# Altium schematic sheet DG_V3.SchDoc
size A4
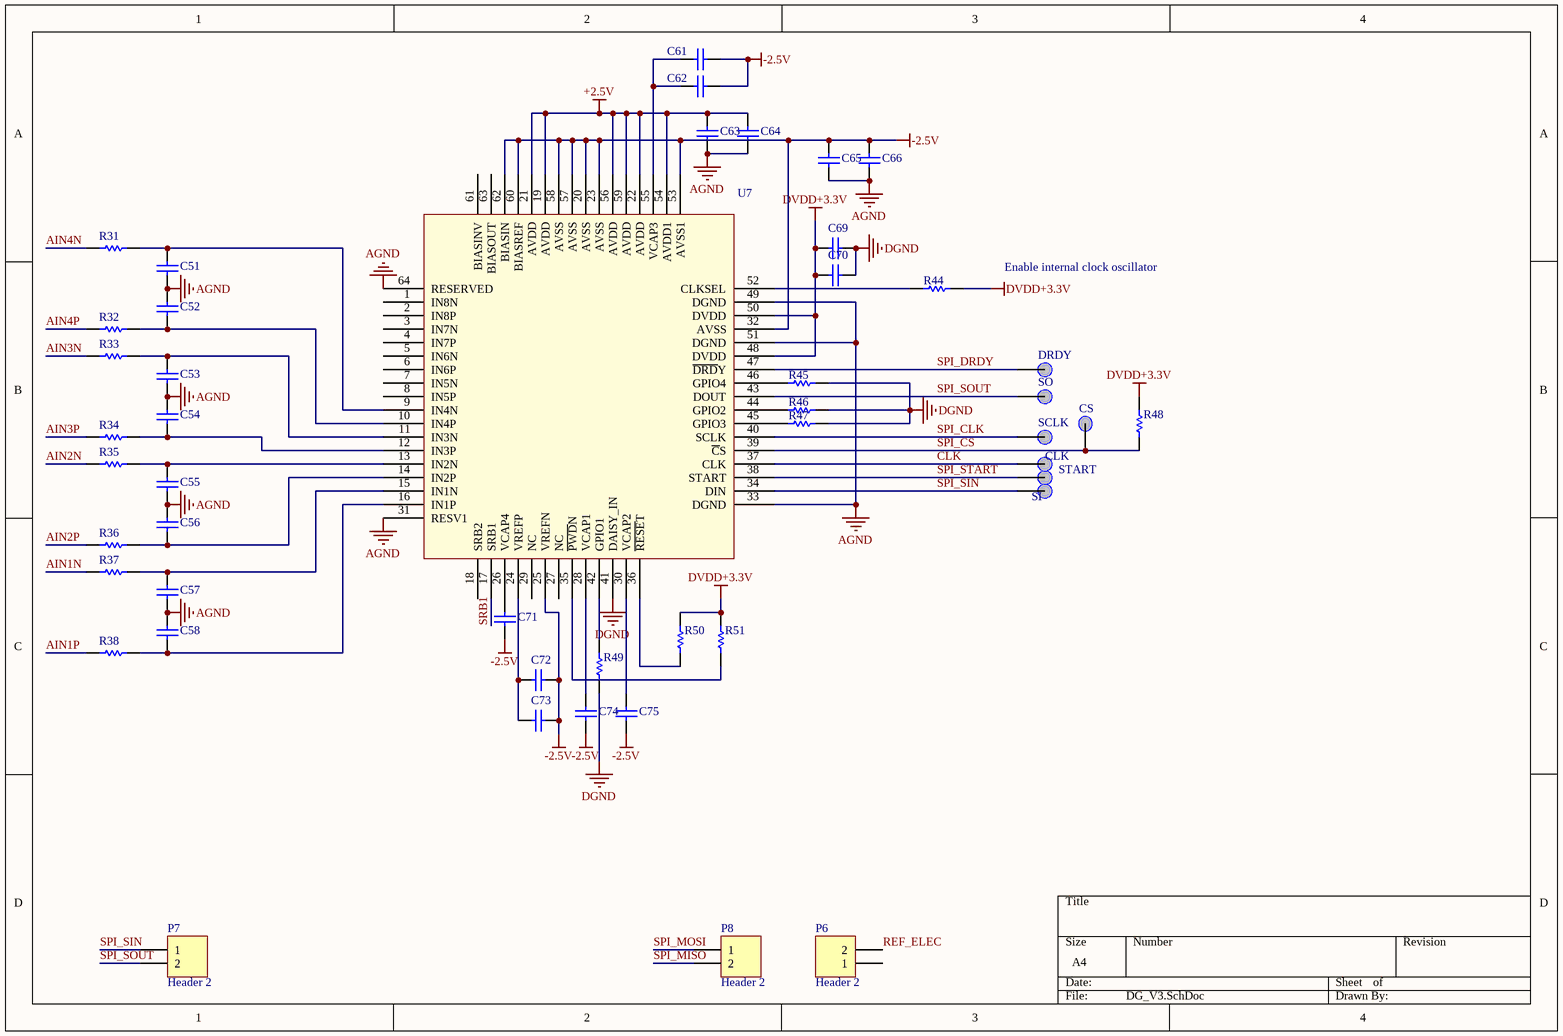
[diagram p0: DG_V3.SchDoc]

## Parts
C51  4.7nF  [1608[0603]]  (value not drawn)
C52  4.7nF  [1608[0603]]  (value not drawn)
C53  4.7nF  [1608[0603]]  (value not drawn)
C54  4.7nF  [1608[0603]]  (value not drawn)
C55  4.7nF  [1608[0603]]  (value not drawn)
C56  4.7nF  [1608[0603]]  (value not drawn)
C57  4.7nF  [1608[0603]]  (value not drawn)
C58  4.7nF  [1608[0603]]  (value not drawn)
C61  100nF  [1608[0603]]  (value not drawn)
C62  1uF  [1608[0603]]  (value not drawn)
C63  1uF  [1608[0603]]  (value not drawn)
C64  0.1uF  [1608[0603]]  (value not drawn)
C65  1uF  [1608[0603]]  (value not drawn)
C66  0.1uF  [1608[0603]]  (value not drawn)
C69  1uF  [1608[0603]]  (value not drawn)
C70  0.1uF  [1608[0603]]  (value not drawn)
C71  1uF  [1608[0603]]  (value not drawn)
C72  10uF  [1608[0603]]  (value not drawn)
C73  100nF  [1608[0603]]  (value not drawn)
C74  100uF  [1608[0603]]  (value not drawn)
C75  1uF  [1608[0603]]  (value not drawn)
CLK  TP  [TestPort]  (value not drawn)
CS  TP  [TestPort]  (value not drawn)
DRDY  TP  [TestPort]  (value not drawn)
P6  Header 2  [HDR1X2]
P7  Header 2  [HDR1X2]
P8  Header 2  [HDR1X2]
R31  4.99K  [J1-0603]  (value not drawn)
R32  4.99K  [J1-0603]  (value not drawn)
R33  4.99K  [J1-0603]  (value not drawn)
R34  4.99K  [J1-0603]  (value not drawn)
R35  4.99K  [J1-0603]  (value not drawn)
R36  4.99K  [J1-0603]  (value not drawn)
R37  4.99K  [J1-0603]  (value not drawn)
R38  4.99K  [J1-0603]  (value not drawn)
R44  10K  [J1-0603]  (value not drawn)
R45  10K  [J1-0603]  (value not drawn)
R46  10K  [J1-0603]  (value not drawn)
R47  10K  [J1-0603]  (value not drawn)
R48  10K  [J1-0603]  (value not drawn)
R49  10K  [J1-0603]  (value not drawn)
R50  10K  [J1-0603]  (value not drawn)
R51  10K  [J1-0603]  (value not drawn)
SCLK  TP  [TestPort]  (value not drawn)
SI  TP  [TestPort]  (value not drawn)
SO  TP  [TestPort]  (value not drawn)
START  TP  [TestPort]  (value not drawn)
U7  ADS1299  [PQFP-64N]  (value not drawn)

## Nets
+2.5V: C63.2 C64.2 U7.19(AVDD) U7.21(AVDD) U7.22(AVDD) U7.54(AVDD1) U7.56(AVDD) U7.59(AVDD)
-2.5V: C61.1 C62.1 C65.2 C66.2 C71.1 C72.2 C73.2 C74.1 C75.1 U7.20(AVSS) U7.23(AVSS) U7.25(VREFN) U7.32(AVSS) U7.53(AVSS1) U7.57(AVSS) U7.58(AVSS) U7.60(BIASREF) U7.62(BIASIN)
AGND: C51.1 C52.2 C53.1 C54.2 C55.1 C56.2 C57.1 C58.2 C63.1 C64.1 C65.1 C66.1 U7.31(RESV1) U7.33(DGND) U7.49(DGND) U7.51(DGND) U7.64(RESERVED)
DGND: C69.1 C70.1 R45.1 R46.1 R47.1 R49.1 U7.41(DAISY_IN)
DVDD+3.3V: C69.2 C70.2 R44.1 R48.1 R50.1 R51.1 U7.48(DVDD) U7.50(DVDD)
AIN1N: R37.1
AIN1P: R38.1
AIN2N: R35.1
AIN2P: R36.1
AIN3N: R33.1
AIN3P: R34.1
AIN4N: R31.1
AIN4P: R32.1
CLK: CLK.0 U7.37(CLK)
REF_ELEC: P6.2
SPI_CLK: SCLK.0 U7.40(SCLK)
SPI_CS: CS.0 R48.2 U7.39(~{C}S)
SPI_DRDY: DRDY.0 U7.47(~{DRD}Y)
SPI_MISO: P8.2
SPI_MOSI: P8.1
SPI_SIN: P7.1 SI.0 U7.34(DIN)
SPI_SOUT: P7.2 SO.0 U7.43(DOUT)
SPI_START: START.0 U7.38(START)
SRB1: U7.17(SRB1)
NetC51_2: C51.2 R31.2 U7.9(IN4N)
NetC52_1: C52.1 R32.2 U7.10(IN4P)
NetC53_2: C53.2 R33.2 U7.11(IN3N)
NetC54_1: C54.1 R34.2 U7.12(IN3P)
NetC55_2: C55.2 R35.2 U7.13(IN2N)
NetC56_1: C56.1 R36.2 U7.14(IN2P)
NetC57_2: C57.2 R37.2 U7.15(IN1N)
NetC58_1: C58.1 R38.2 U7.16(IN1P)
NetC61_2: C61.2 C62.2 U7.55(VCAP3)
NetC71_2: C71.2 U7.26(VCAP4)
NetC72_1: C72.1 C73.1 U7.24(VREFP)
NetC74_2: C74.2 U7.28(VCAP1)
NetC75_2: C75.2 U7.30(VCAP2)
NetR44_2: R44.2 U7.52(CLKSEL)
NetR45_2: R45.2 U7.46(GPIO4)
NetR46_2: R46.2 U7.44(GPIO2)
NetR47_2: R47.2 U7.45(GPIO3)
NetR49_2: R49.2 U7.42(GPIO1)
NetR50_2: R50.2 U7.36(~{RESE}T)
NetR51_2: R51.2 U7.35(~{PWD}N)

Not connected (* = marked no-connect by the designer): P6 1; U7 1(IN8N) 2(IN8P) 3(IN7N) 4(IN7P) 5(IN6N) 6(IN6P) 7(IN5N) 8(IN5P) 18(SRB2) 27(NC) 29(NC) 61(BIASINV) 63(BIASOUT)

## Notes on the sheet
- Enable internal clock oscillator

## Library data of the parts
C51-C58 C61-C66 C69-C75 = Cap: Capacitor; Published: 8-Jun-2000; LatestRevisionDate: 17-Jul-2002; LatestRevisionNote: Re-released for DXP Platform.; PackageReference: RAD-0.3; Publisher: Altium Limited; PackageDescription: Radial Cap, Thru-Hole; 2 Leads; 0.3 in Pin Spacing
  C51-C58: Value: 4.7nF
  C61 C73: Value: 100nF
  C62 C63 C65 C69 C71 C75: Value: 1uF
  C64 C66 C70: Value: 0.1uF
  C72: Value: 10uF
  C74: Value: 100uF
CLK CS DRDY SCLK SI SO START = TestPoint
P6-P8 = Header 2: Header, 2-Pin; LatestRevisionDate: 17-Jul-2002; LatestRevisionNote: Re-released for DXP Platform.; Publisher: Altium Limited
R31-R38 R44-R51 = Res1: Resistor; Published: 8-Jun-2000; LatestRevisionDate: 17-Jul-2002; LatestRevisionNote: Re-released for DXP Platform.; PackageReference: AXIAL-0.3; Publisher: Altium Limited
  R31-R38: PackageDescription: Axial Device, Thru-Hole; 2 Leads; 0.3 in Pin Spacing; Value: 4.99K
  R44-R47 R49-R51: PackageDescription: Axial Device, Thru-Hole; 2 Leads; 0.3 in Pin Spacing; Value: 10K
  R48: Value: 10K